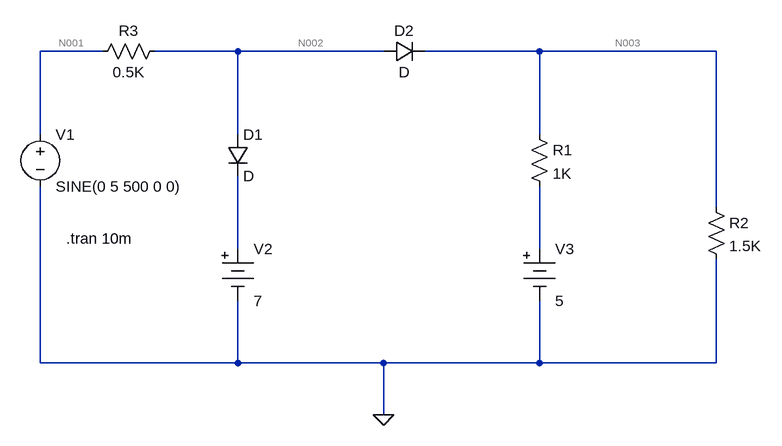
[diagram p0: schematic Assignment 4.asc]
Assignment 4.asc, the LTspice schematic file:
Version 4
SHEET 1 1288 680
WIRE 80 -128 -16 -128
WIRE 288 -128 160 -128
WIRE 512 -128 288 -128
WIRE 752 -128 576 -128
WIRE 1024 -128 752 -128
WIRE -16 0 -16 -128
WIRE 288 0 288 -128
WIRE 752 0 752 -128
WIRE 1024 112 1024 -128
WIRE 288 176 288 64
WIRE 752 176 752 80
WIRE -16 352 -16 80
WIRE 288 352 288 256
WIRE 288 352 -16 352
WIRE 512 352 288 352
WIRE 752 352 752 256
WIRE 752 352 512 352
WIRE 1024 352 1024 192
WIRE 1024 352 752 352
WIRE 512 432 512 352
FLAG 512 432 0
SYMBOL voltage -16 -16 R0
WINDOW 123 24 124 Left 2
WINDOW 39 0 0 Left 0
SYMATTR InstName V1
SYMATTR Value SINE(0 5 500 0 0)
SYMBOL diode 272 0 R0
SYMATTR InstName D1
SYMBOL Misc\\battery 288 160 R0
WINDOW 123 0 0 Left 0
WINDOW 39 0 0 Left 0
SYMATTR InstName V2
SYMATTR Value 7
SYMBOL diode 512 -112 R270
WINDOW 0 32 32 VTop 2
WINDOW 3 0 32 VBottom 2
SYMATTR InstName D2
SYMBOL res 736 -16 R0
SYMATTR InstName R1
SYMATTR Value 1K
SYMBOL Misc\\battery 752 160 R0
WINDOW 123 0 0 Left 0
WINDOW 39 0 0 Left 0
SYMATTR InstName V3
SYMATTR Value 5
SYMBOL res 1008 96 R0
SYMATTR InstName R2
SYMATTR Value 1.5K
SYMBOL res 176 -144 R90
WINDOW 0 0 56 VBottom 2
WINDOW 3 32 56 VTop 2
SYMATTR InstName R3
SYMATTR Value 0.5K
TEXT 24 160 Left 2 !.tran 10m

The netlist it stands for:
* Assignment 4.asc
V1 N001 0 SINE(0 5 500 0 0)
D1 N002 N004 D
V2 N004 0 7
D2 N002 N003 D
R1 N003 N005 1K
V3 N005 0 5
R2 N003 0 1.5K
R3 N002 N001 0.5K
.model D D
.lib standard.dio
.tran 10m
.backanno
.end

* Results of the author's LTspice run, read from the files saved beside the schematic
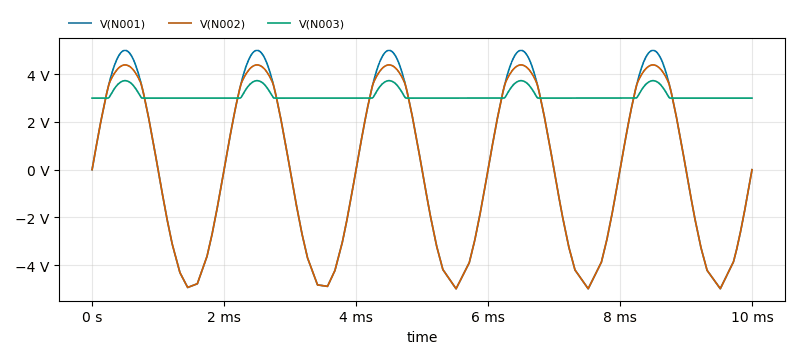
[diagram p1: Transient Analysis of Assignment 4.asc, plotted from the saved traces]
* Transient Analysis, 1 run:
*   V(N001): min -4.989 V, max 5 V, average 27.46 mV, rms 3.512 V, last 0 V
*   V(N002): min -4.988 V, max 4.39 V, average -70.15 mV, rms 3.384 V, last 0 V
*   V(N003): min 3 V, max 3.73 V, average 3.117 V, rms 3.126 V, last 3 V